# Altium project DCDC.PrjPcb (part 3 of 9)
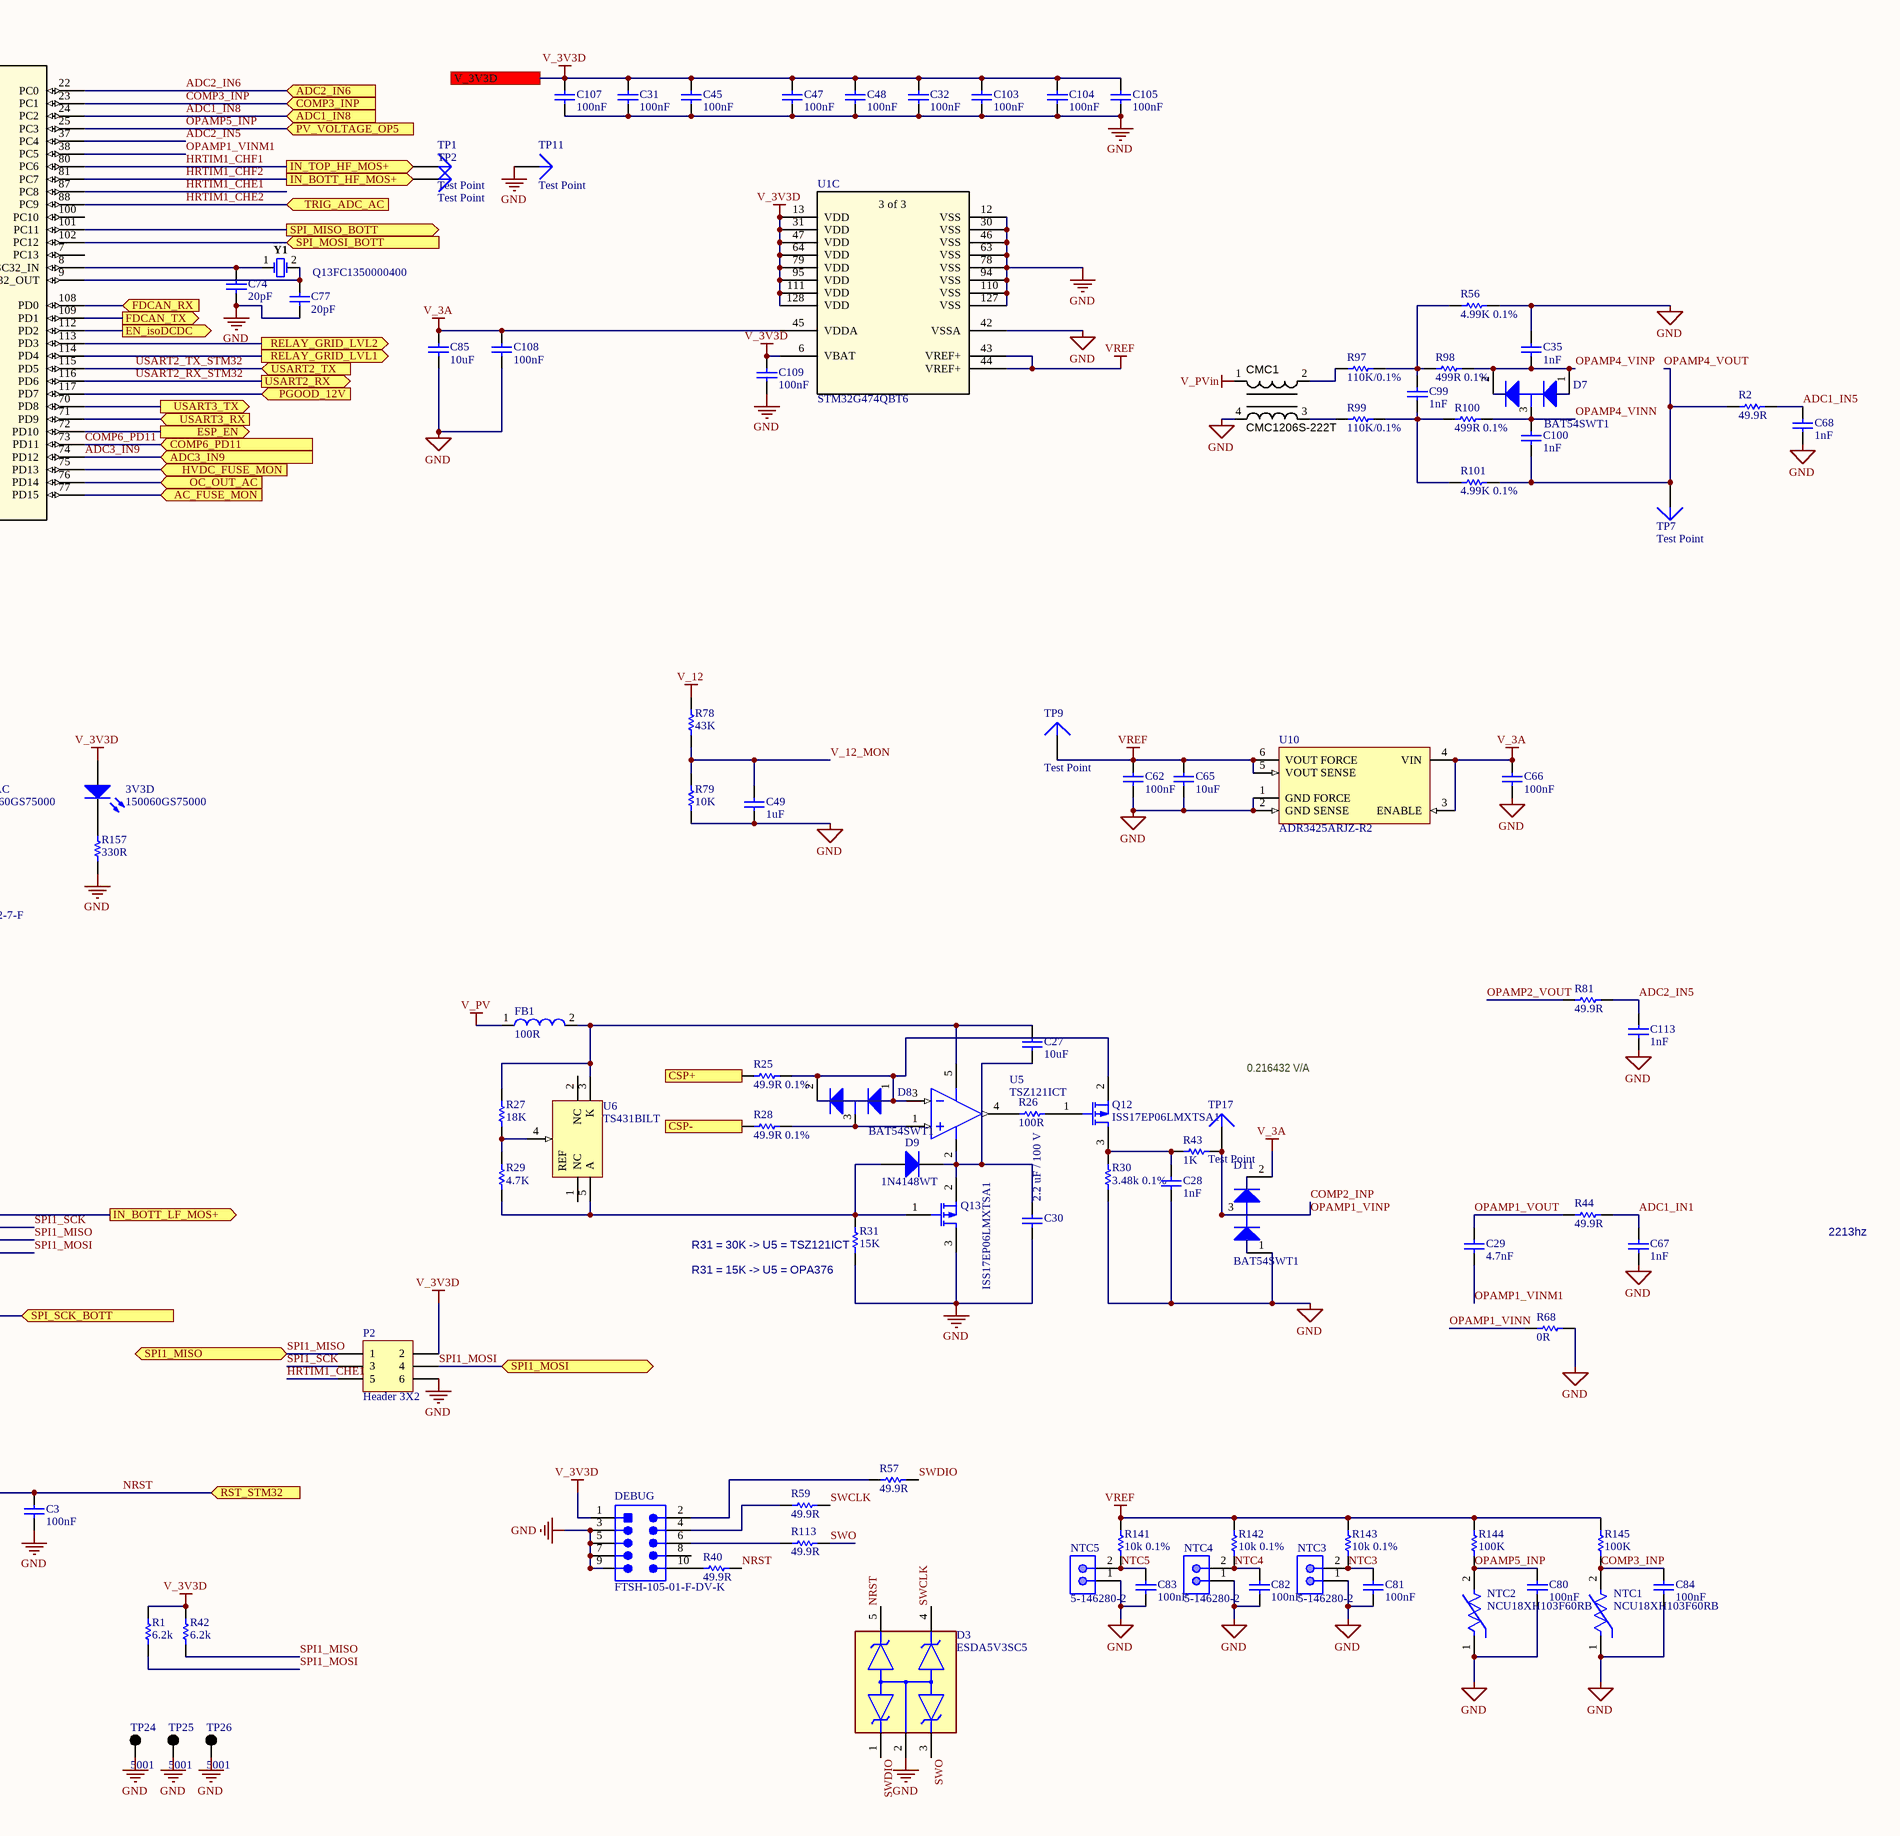
[diagram p10: MCU.SchDoc, right]

## Sheet MCU.SchDoc (continued)

### Library data of the parts (continued)
R43 = RES: ±1% ±100ppm/℃ 1kΩ 0.1W 0603 Chip Resistor - Surface Mount ROHS; Part Number: ERJ-3EKF1001V; Manufacturer: Panasonic; Manufacturer Part Number: ERJ3EKF1001V; Resistance: 1kR; Power Rating: 100mW; Voltage Rating: 75V; Temperature Coefficient: 100ppm/°C; Supplier 1: Future Electronics; Supplier Part Number 1: 3028514; RoHS: Yes; Category: Chip SMD Resistors; Stock 1: 430000; Pricing 1: 5000=0.01860, 10000=0.01510, 15000=0.01500, 20000=0.01490 (USD); Mount: Surface Mount; Case/Package: 0603; Number of Pins: 2; Case Code (Metric): 1608; Case Code (Imperial): 0603; Contact Plating: Tin; Size Code: 0603; Min Operating Temperature: -55°C; Max Operating Temperature: 155°C; Packaging: Tape and Reel; Tolerance: 1%; Termination: SMD/SMT; Package Quantity: 5000; Series: ERJ; Resistor Type: Thick Film; Max Power Dissipation: 100mW; Construction: Rectangular; Resistance Tolerance: 1%; Number of Terminations: 2; Features: Automotive AEC-Q200; Voltage Rating (DC): 75V; Technology: THICK FILM; Length: 1.6mm; Width: 0.8mm; Height: 0.45mm; Depth: 0.8mm; Radiation Hardening: No; REACH SVHC: No SVHC; Lead Free: Lead Free; RoHS Compliant: Yes; Military Standard: Not; ComponentLink1URL: https://datasheet.ciiva.com/16768/70260748-16768437.pdf?src-supplier=Allied+Electronics; ComponentLink1Description: https://datasheet.ciiva.com/16768/70260748-16768437.pdf?src-supplier=Allied+Electronics; ComponentLink2URL: https://datasheet.ciiva.com/16774/70260748-16774550.pdf?src-supplier=Allied+Electronics; ComponentLink2Description: https://datasheet.ciiva.com/16774/70260748-16774550.pdf?src-supplier=Allied+Electronics; ComponentLink3URL: https://datasheet.ciiva.com/16449/aoa0000ce2-16449065.pdf?src-supplier=Future+Electronics; ComponentLink3Description: https://datasheet.ciiva.com/16449/aoa0000ce2-16449065.pdf?src-supplier=Future+Electronics; ComponentLink4URL: https://datasheet.ciiva.com/7942/aoa0000ce2-7942427.pdf?src-supplier=Element14; ComponentLink4Description: https://datasheet.ciiva.com/7942/aoa0000ce2-7942427.pdf?src-supplier=Element14; ComponentLink5URL: https://datasheet.ciiva.com/9198/aoa0000ce2-9198923.pdf?src-supplier=Avnet; ComponentLink5Description: https://datasheet.ciiva.com/9198/aoa0000ce2-9198923.pdf?src-supplier=Avnet; ComponentLink6URL: https://datasheet.ciiva.com/46373/1678782-46373339.pdf?src-supplier=Element14; ComponentLink6Description: https://datasheet.ciiva.com/46373/1678782-46373339.pdf?src-supplier=Element14; ComponentLink7URL: https://datasheet.ciiva.com/48530/aoa0000ce2-48530987.pdf?src-supplier=Avnet; ComponentLink7Description: https://datasheet.ciiva.com/48530/aoa0000ce2-48530987.pdf?src-supplier=Avnet; ComponentLink8URL: https://datasheet.ciiva.com/46373/1678782-46373340.pdf?src-supplier=Element14; ComponentLink8Description: https://datasheet.ciiva.com/46373/1678782-46373340.pdf?src-supplier=Element14; ComponentLink9URL: https://datasheet.ciiva.com/24070/aoa0000ce2-24070269.pdf?src-supplier=Mouser; ComponentLink9Description: https://datasheet.ciiva.com/24070/aoa0000ce2-24070269.pdf?src-supplier=Mouser; ComponentLink10URL: https://datasheet.ciiva.com/22673/1678782-22673918.pdf?src-supplier=Element14; ComponentLink10Description: https://datasheet.ciiva.com/22673/1678782-22673918.pdf?src-supplier=Element14; ComponentLink11URL: https://datasheet.ciiva.com/30063/aoa0000ce2-30063390.pdf?src-supplier=Onlinecomponents.com; ComponentLink11Description: https://datasheet.ciiva.com/30063/aoa0000ce2-30063390.pdf?src-supplier=Onlinecomponents.com; ComponentLink12URL: https://datasheet.ciiva.com/17215/aoa0000ce2-17215311.pdf?src-supplier=Avnet+Europe; ComponentLink12Description: https://datasheet.ciiva.com/17215/aoa0000ce2-17215311.pdf?src-supplier=Avnet+Europe; Parameter 1: *; JLCPCB Part #: C21190
R56 R101 = CMP-2000-00874-1: Part Number: ERA-3AEB103V; Manufacturer: Panasonic; Resistance: 10kR; Temperature Coefficient: 25ppm/°C; Power Rating: 100mW; Voltage Rating: 75V; Supplier 1: Digi-Key; Supplier Part Number 1: P10KDBCT-ND; Manufacturer Part Number: ERA-3AEB103V; Stock 1: 1673404; Pricing 1: 1=0,35000, 10=0,30000, 100=0,11720, 1000=0,04906, 2500=0,04498 (USD); RoHS: Yes; Mount: Surface Mount; Case/Package: 0603; Number of Pins: 2; Contact Plating: Tin; Case Code (Metric): 1608; Case Code (Imperial): 0603; Min Operating Temperature: -55°C; Max Operating Temperature: 155°C; Tolerance: 0.1%; Composition: Thin Film,Metal Film; Packaging: Tape and Reel; Package Quantity: 5000; Number of Terminations: 2; Termination: SMD/SMT; Military Standard: Not; Max Power Dissipation: 100mW; Voltage Rating (DC): 75V; Length: 1.6mm; Height: 0.45mm; Width: 0.8mm; Depth: 0.8mm; Radiation Hardening: No; REACH SVHC: No SVHC; Lead Free: Lead Free; ComponentLink1URL: https://datasheet.ciiva.com/5734/485442-5734528.pdf?src-supplier=Farnell; ComponentLink1Description: https://datasheet.ciiva.com/5734/485442-5734528.pdf?src-supplier=Farnell; ComponentLink2URL: https://datasheet.ciiva.com/11808/0900766b80fe20f7-11808028.pdf?src-supplier=RSComponents; ComponentLink2Description: https://datasheet.ciiva.com/11808/0900766b80fe20f7-11808028.pdf?src-supplier=RSComponents; ComponentLink3URL: https://datasheet.ciiva.com/29183/451250-da-01-en-widerstand-0603-era-29183809.pdf?src-supplier=Conrad; ComponentLink3Description: https://datasheet.ciiva.com/29183/451250-da-01-en-widerstand-0603-era-29183809.pdf?src-supplier=Conrad; ComponentLink4URL: https://datasheet.ciiva.com/46422/1776116-46422520.pdf?src-supplier=Element14; ComponentLink4Description: https://datasheet.ciiva.com/46422/1776116-46422520.pdf?src-supplier=Element14; ComponentLink5URL: https://datasheet.ciiva.com/24072/aoa0000ce26-197354-24072585.pdf?src-supplier=Mouser; ComponentLink5Description: https://datasheet.ciiva.com/24072/aoa0000ce26-197354-24072585.pdf?src-supplier=Mouser; ComponentLink6URL: https://datasheet.ciiva.com/30126/54aoa0000ce26-30126478.pdf?src-supplier=Onlinecomponents.com; ComponentLink6Description: https://datasheet.ciiva.com/30126/54aoa0000ce26-30126478.pdf?src-supplier=Onlinecomponents.com; ComponentLink7URL: https://datasheet.ciiva.com/5734/aoa0000ce26-5734527.pdf?src-supplier=Farnell; ComponentLink7Description: https://datasheet.ciiva.com/5734/aoa0000ce26-5734527.pdf?src-supplier=Farnell; ComponentLink8URL: https://datasheet.ciiva.com/17212/aoa0000ce26-17212070.pdf?src-supplier=Avnet+Europe; ComponentLink8Description: https://datasheet.ciiva.com/17212/aoa0000ce26-17212070.pdf?src-supplier=Avnet+Europe; ComponentLink9URL: https://datasheet.ciiva.com/9194/aoa0000ce26-9194213.pdf?src-supplier=Avnet; ComponentLink9Description: https://datasheet.ciiva.com/9194/aoa0000ce26-9194213.pdf?src-supplier=Avnet; ComponentLink10URL: https://datasheet.ciiva.com/46376/485442-46376357.pdf?src-supplier=Element14; ComponentLink10Description: https://datasheet.ciiva.com/46376/485442-46376357.pdf?src-supplier=Element14; ComponentLink11URL: https://datasheet.ciiva.com/16427/aoa0000ce26-16427097.pdf?src-supplier=Future+Electronics; ComponentLink11Description: https://datasheet.ciiva.com/16427/aoa0000ce26-16427097.pdf?src-supplier=Future+Electronics; ComponentLink12URL: https://datasheet.ciiva.com/46388/1776116-46388109.pdf?src-supplier=Element14; ComponentLink12Description: https://datasheet.ciiva.com/46388/1776116-46388109.pdf?src-supplier=Element14; ComponentLink13URL: https://datasheet.ciiva.com/46388/485442-46388110.pdf?src-supplier=Element14; ComponentLink13Description: https://datasheet.ciiva.com/46388/485442-46388110.pdf?src-supplier=Element14; Parameter 1: *; JLCPCB Part #: *
R78 = CMP-2000-00918-1: ±1% ±100ppm/℃ 43kΩ 0.1W 0603 Chip Resistor - Surface Mount ROHS; Part Number: ERA3AEB154V; Manufacturer: Panasonic; Manufacturer Part Number: ERA-3AEB154V; Resistance: 150kR; Tolerance: 0.1%; Temperature Coefficient: 25ppm/°C; Power Rating: 100mW; Voltage Rating: 75V; Supplier 1: Digi-Key; Supplier Part Number 1: P150KDBCT-ND; Stock 1: 137847; Pricing 1: 1=0,35000, 10=0,30000, 100=0,11720, 1000=0,04906, 2500=0,04498 (USD); RoHS: Yes; Mount: Surface Mount; Case/Package: 0603; Number of Pins: 2; Case Code (Metric): 1608; Case Code (Imperial): 0603; Contact Plating: Tin; Min Operating Temperature: -55°C; Max Operating Temperature: 155°C; Packaging: Tape and Reel; Composition: Metal Film,Thin Film; Termination: SMD/SMT; Number of Terminations: 2; Voltage Rating (DC): 75V; Package Quantity: 1; Max Power Dissipation: 100mW; Features: Automotive AEC-Q200; Military Standard: Not; Length: 1.6mm; Height: 0.45mm; Width: 0.8mm; Depth: 0.8mm; Radiation Hardening: No; Lead Free: Lead Free; REACH SVHC: No SVHC; ComponentLink1URL: https://datasheet.ciiva.com/11808/0900766b80fe20f7-11808025.pdf?src-supplier=RSComponents; ComponentLink1Description: https://datasheet.ciiva.com/11808/0900766b80fe20f7-11808025.pdf?src-supplier=RSComponents; ComponentLink2URL: https://datasheet.ciiva.com/29183/451718-da-01-en-widerstand-0603-era-29183878.pdf?src-supplier=Conrad; ComponentLink2Description: https://datasheet.ciiva.com/29183/451718-da-01-en-widerstand-0603-era-29183878.pdf?src-supplier=Conrad; ComponentLink3URL: https://datasheet.ciiva.com/24070/aoa0000ce26-197354-24070709.pdf?src-supplier=Mouser; ComponentLink3Description: https://datasheet.ciiva.com/24070/aoa0000ce26-197354-24070709.pdf?src-supplier=Mouser; ComponentLink4URL: https://datasheet.ciiva.com/9117/aoa0000ce26-9117369.pdf?src-supplier=Avnet; ComponentLink4Description: https://datasheet.ciiva.com/9117/aoa0000ce26-9117369.pdf?src-supplier=Avnet; ComponentLink5URL: https://datasheet.ciiva.com/16767/70068849-16767065.pdf?src-supplier=Allied+Electronics; ComponentLink5Description: https://datasheet.ciiva.com/16767/70068849-16767065.pdf?src-supplier=Allied+Electronics; ComponentLink6URL: https://datasheet.ciiva.com/30175/54aoa0000ce26-30175385.pdf?src-supplier=Onlinecomponents.com; ComponentLink6Description: https://datasheet.ciiva.com/30175/54aoa0000ce26-30175385.pdf?src-supplier=Onlinecomponents.com; ComponentLink7URL: https://datasheet.ciiva.com/6001/485442-6001674.pdf?src-supplier=Farnell; ComponentLink7Description: https://datasheet.ciiva.com/6001/485442-6001674.pdf?src-supplier=Farnell; ComponentLink8URL: https://datasheet.ciiva.com/6001/485442-6001675.pdf?src-supplier=Farnell; ComponentLink8Description: https://datasheet.ciiva.com/6001/485442-6001675.pdf?src-supplier=Farnell; ComponentLink9URL: https://datasheet.ciiva.com/17207/aoa0000ce26-17207467.pdf?src-supplier=Avnet+Europe; ComponentLink9Description: https://datasheet.ciiva.com/17207/aoa0000ce26-17207467.pdf?src-supplier=Avnet+Europe; ComponentLink10URL: https://datasheet.ciiva.com/36857/485442-36857163.pdf?src-supplier=Element14; ComponentLink10Description: https://datasheet.ciiva.com/36857/485442-36857163.pdf?src-supplier=Element14; ComponentLink11URL: https://datasheet.ciiva.com/9117/aoa0000ce26-9117373.pdf?src-supplier=Avnet; ComponentLink11Description: https://datasheet.ciiva.com/9117/aoa0000ce26-9117373.pdf?src-supplier=Avnet; ComponentLink12URL: https://datasheet.ciiva.com/43455/485442-43455245.pdf?src-supplier=Farnell; ComponentLink12Description: https://datasheet.ciiva.com/43455/485442-43455245.pdf?src-supplier=Farnell; ComponentLink13URL: https://datasheet.ciiva.com/16212/aoa0000ce26-16212095.pdf?src-supplier=Future+Electronics; ComponentLink13Description: https://datasheet.ciiva.com/16212/aoa0000ce26-16212095.pdf?src-supplier=Future+Electronics; ComponentLink14URL: https://datasheet.ciiva.com/16770/70068849-16770767.pdf?src-supplier=Allied+Electronics; ComponentLink14Description: https://datasheet.ciiva.com/16770/70068849-16770767.pdf?src-supplier=Allied+Electronics; ComponentLink15URL: https://datasheet.ciiva.com/28691/485442-28691903.pdf?src-supplier=Element14; ComponentLink15Description: https://datasheet.ciiva.com/28691/485442-28691903.pdf?src-supplier=Element14; Parameter 1: *; JLCPCB Part #: C23172
R81 = CMP-2002-00969-1: 1/16W ±1% ±200ppm/℃ 49.9Ω 0402 Chip Resistor - Surface Mount ROHS; Manufacturer: Panasonic; Part Number: ERJ-2RKF49R9X; Parameter 1: *; JLCPCB Part #: C25120
R97 R99 = CMP-2000-00918-1: Part Number: ERA3AEB154V; Manufacturer: Panasonic; Manufacturer Part Number: ERA-3AEB154V; Resistance: 150kR; Tolerance: 0.1%; Temperature Coefficient: 25ppm/°C; Power Rating: 100mW; Voltage Rating: 75V; Supplier 1: Digi-Key; Supplier Part Number 1: P150KDBCT-ND; Stock 1: 137847; Pricing 1: 1=0,35000, 10=0,30000, 100=0,11720, 1000=0,04906, 2500=0,04498 (USD); RoHS: Yes; Mount: Surface Mount; Case/Package: 0603; Number of Pins: 2; Case Code (Metric): 1608; Case Code (Imperial): 0603; Contact Plating: Tin; Min Operating Temperature: -55°C; Max Operating Temperature: 155°C; Packaging: Tape and Reel; Composition: Metal Film,Thin Film; Termination: SMD/SMT; Number of Terminations: 2; Voltage Rating (DC): 75V; Package Quantity: 1; Max Power Dissipation: 100mW; Features: Automotive AEC-Q200; Military Standard: Not; Length: 1.6mm; Height: 0.45mm; Width: 0.8mm; Depth: 0.8mm; Radiation Hardening: No; Lead Free: Lead Free; REACH SVHC: No SVHC; ComponentLink1URL: https://datasheet.ciiva.com/11808/0900766b80fe20f7-11808025.pdf?src-supplier=RSComponents; ComponentLink1Description: https://datasheet.ciiva.com/11808/0900766b80fe20f7-11808025.pdf?src-supplier=RSComponents; ComponentLink2URL: https://datasheet.ciiva.com/29183/451718-da-01-en-widerstand-0603-era-29183878.pdf?src-supplier=Conrad; ComponentLink2Description: https://datasheet.ciiva.com/29183/451718-da-01-en-widerstand-0603-era-29183878.pdf?src-supplier=Conrad; ComponentLink3URL: https://datasheet.ciiva.com/24070/aoa0000ce26-197354-24070709.pdf?src-supplier=Mouser; ComponentLink3Description: https://datasheet.ciiva.com/24070/aoa0000ce26-197354-24070709.pdf?src-supplier=Mouser; ComponentLink4URL: https://datasheet.ciiva.com/9117/aoa0000ce26-9117369.pdf?src-supplier=Avnet; ComponentLink4Description: https://datasheet.ciiva.com/9117/aoa0000ce26-9117369.pdf?src-supplier=Avnet; ComponentLink5URL: https://datasheet.ciiva.com/16767/70068849-16767065.pdf?src-supplier=Allied+Electronics; ComponentLink5Description: https://datasheet.ciiva.com/16767/70068849-16767065.pdf?src-supplier=Allied+Electronics; ComponentLink6URL: https://datasheet.ciiva.com/30175/54aoa0000ce26-30175385.pdf?src-supplier=Onlinecomponents.com; ComponentLink6Description: https://datasheet.ciiva.com/30175/54aoa0000ce26-30175385.pdf?src-supplier=Onlinecomponents.com; ComponentLink7URL: https://datasheet.ciiva.com/6001/485442-6001674.pdf?src-supplier=Farnell; ComponentLink7Description: https://datasheet.ciiva.com/6001/485442-6001674.pdf?src-supplier=Farnell; ComponentLink8URL: https://datasheet.ciiva.com/6001/485442-6001675.pdf?src-supplier=Farnell; ComponentLink8Description: https://datasheet.ciiva.com/6001/485442-6001675.pdf?src-supplier=Farnell; ComponentLink9URL: https://datasheet.ciiva.com/17207/aoa0000ce26-17207467.pdf?src-supplier=Avnet+Europe; ComponentLink9Description: https://datasheet.ciiva.com/17207/aoa0000ce26-17207467.pdf?src-supplier=Avnet+Europe; ComponentLink10URL: https://datasheet.ciiva.com/36857/485442-36857163.pdf?src-supplier=Element14; ComponentLink10Description: https://datasheet.ciiva.com/36857/485442-36857163.pdf?src-supplier=Element14; ComponentLink11URL: https://datasheet.ciiva.com/9117/aoa0000ce26-9117373.pdf?src-supplier=Avnet; ComponentLink11Description: https://datasheet.ciiva.com/9117/aoa0000ce26-9117373.pdf?src-supplier=Avnet; ComponentLink12URL: https://datasheet.ciiva.com/43455/485442-43455245.pdf?src-supplier=Farnell; ComponentLink12Description: https://datasheet.ciiva.com/43455/485442-43455245.pdf?src-supplier=Farnell; ComponentLink13URL: https://datasheet.ciiva.com/16212/aoa0000ce26-16212095.pdf?src-supplier=Future+Electronics; ComponentLink13Description: https://datasheet.ciiva.com/16212/aoa0000ce26-16212095.pdf?src-supplier=Future+Electronics; ComponentLink14URL: https://datasheet.ciiva.com/16770/70068849-16770767.pdf?src-supplier=Allied+Electronics; ComponentLink14Description: https://datasheet.ciiva.com/16770/70068849-16770767.pdf?src-supplier=Allied+Electronics; ComponentLink15URL: https://datasheet.ciiva.com/28691/485442-28691903.pdf?src-supplier=Element14; ComponentLink15Description: https://datasheet.ciiva.com/28691/485442-28691903.pdf?src-supplier=Element14; Parameter 1: *; JLCPCB Part #: *
R98 R100 = RES: Res Thin Film 0603 499 Ohm 0.1% 1/10W ±25ppm/°C Molded SMD SMD Punched Carrier T/R; Part Number: ERA3AEB4990V; Manufacturer: Panasonic; Manufacturer Part Number: ERA-3AEB4990V; Power Rating: 100mW; Voltage Rating: 150V; Voltage Rating (DC): 75V; Supplier 1: Digi-Key; Supplier Part Number 1: P499DBCT-ND; RoHS: Yes; Category: Chip SMD Resistors; Stock 1: 51561; Pricing 1: 1=0.31000, 10=0.26000, 100=0.10150, 1000=0.04248, 2500=0.03894 (USD); Mount: Surface Mount; Case/Package: 0603; Number of Pins: 2; Case Code (Metric): 1608; Case Code (Imperial): 0603; Contact Plating: Tin; Min Operating Temperature: -55°C; Max Operating Temperature: 155°C; Resistance: 499R; Tolerance: 0.1%; Packaging: Tape and Reel; Resistor Type: Thin Film,Metal Film; Temperature Coefficient: 25ppm/°C; Package Quantity: 1; Number of Terminations: 2; Termination: SMD/SMT; Max Power Dissipation: 100mW; Series: ERA-3A; Resistance Tolerance: 0.1%; Construction: Rectangular; Features: Automotive AEC-Q200; Technology: METAL FILM; Length: 1.6mm; Width: 0.8mm; Height: 0.45mm; Depth: 0.8mm; Radiation Hardening: No; RoHS Compliant: Yes; Lead Free: Lead Free; REACH SVHC: No SVHC; Military Standard: Not; ComponentLink1URL: https://datasheet.ciiva.com/11810/0900766b80eb1d8c-11810911.pdf?src-supplier=RSComponents; ComponentLink1Description: https://datasheet.ciiva.com/11810/0900766b80eb1d8c-11810911.pdf?src-supplier=RSComponents; ComponentLink2URL: https://datasheet.ciiva.com/29183/451973-da-01-en-widerstand-0603-era-29183924.pdf?src-supplier=Conrad; ComponentLink2Description: https://datasheet.ciiva.com/29183/451973-da-01-en-widerstand-0603-era-29183924.pdf?src-supplier=Conrad; ComponentLink3URL: https://datasheet.ciiva.com/9181/aoa0000ce26-9181477.pdf?src-supplier=Avnet; ComponentLink3Description: https://datasheet.ciiva.com/9181/aoa0000ce26-9181477.pdf?src-supplier=Avnet; ComponentLink4URL: https://datasheet.ciiva.com/17205/aoa0000ce26-17205477.pdf?src-supplier=Avnet+Europe; ComponentLink4Description: https://datasheet.ciiva.com/17205/aoa0000ce26-17205477.pdf?src-supplier=Avnet+Europe; ComponentLink5URL: https://datasheet.ciiva.com/30161/54aoa0000ce26-30161593.pdf?src-supplier=Onlinecomponents.com; ComponentLink5Description: https://datasheet.ciiva.com/30161/54aoa0000ce26-30161593.pdf?src-supplier=Onlinecomponents.com; ComponentLink6URL: https://datasheet.ciiva.com/7920/485442-7920378.pdf?src-supplier=Element14; ComponentLink6Description: https://datasheet.ciiva.com/7920/485442-7920378.pdf?src-supplier=Element14; ComponentLink7URL: https://datasheet.ciiva.com/7920/485442-7920379.pdf?src-supplier=Element14; ComponentLink7Description: https://datasheet.ciiva.com/7920/485442-7920379.pdf?src-supplier=Element14; ComponentLink8URL: https://datasheet.ciiva.com/6201/485442-6201036.pdf?src-supplier=Farnell; ComponentLink8Description: https://datasheet.ciiva.com/6201/485442-6201036.pdf?src-supplier=Farnell; Parameter 1: *; JLCPCB Part #: *
R107 R108 = CMP-1659-00020-2: ±1% 330Ω ±100ppm/℃ 0.1W 0603 Chip Resistor - Surface Mount ROHS; Tolerance: 10%; ESR: 800 mohm; Voltage Rating (DC): 16 V; Capacitance: 47 uF; Length: 7.3 mm; ComponentLink1URL: http://www.yageo.com/; Packaging: Tape and Reel; Pins: 2; ComponentLink1Description: Manufacturer URL; Case Code (Imperial): 2917; REACH SVHC: No SVHC; Width: 4.3 mm; ComponentLink2Description: Datasheet; Voltage Rating: 16 V; RoHSCompliant: True; Max Operating Temperature: 125degC; ComponentLink2URL: http://www.yageo.com/documents/recent/PYu-RC_Group_51_RoHS_L_04.pdf; Min Operating Temperature: -55degC; Case/Package: 2917; Radiation Hardening: No; DatasheetVersion: Rev. 4, 02/2016; Mount: Surface Mount; PackageReference: 0603; Package Quantity: 500; Case Code (Metric): 7343; PackageDescription: 2-Pin Surface Mount Device, Body 1.6 x 0.8 mm; Height: 3.1 mm; Parameter 1: *; JLCPCB Part #: C23138
R125 R153 = RES-2: ±1% 330Ω ±100ppm/℃ 0.1W 0603 Chip Resistor - Surface Mount ROHS; Manufacturer: Yageo; Manufacturer Part Number: RC0603FR-07330RL; Tolerance: 10%; ESR: 800 mohm; Voltage Rating (DC): 16 V; Capacitance: 47 uF; Temperature Coefficient: 100ppm/°C; Power Rating: 100mW; Length: 7.3 mm; ComponentLink1URL: http://www.yageo.com/; Packaging: Tape and Reel; Pins: 2; ComponentLink1Description: Manufacturer URL; Case Code (Imperial): 2917; REACH SVHC: No SVHC; Width: 4.3 mm; ComponentLink2Description: Datasheet; Voltage Rating: 16 V; RoHSCompliant: True; Max Operating Temperature: 125degC; ComponentLink2URL: http://www.yageo.com/documents/recent/PYu-RC_Group_51_RoHS_L_04.pdf; Min Operating Temperature: -55degC; Case/Package: 2917; Radiation Hardening: No; DatasheetVersion: Rev. 4, 02/2016; Mount: Surface Mount; PackageReference: 0603; Package Quantity: 500; Case Code (Metric): 7343; PackageDescription: 2-Pin Surface Mount Device, Body 1.6 x 0.8 mm; Height: 3.1 mm; Supplier 1: Digi-Key; Supplier Part Number 1: 311-330HRCT-ND; RoHS: Yes; Category: Chip SMD Resistors; Stock 1: 4209654; Pricing 1: 1=0.10000, 10=0.02300, 100=0.00940, 1000=0.00421, 2500=0.00366 (USD); Number of Pins: 2; Composition: Thick Film; Resistance: 330R; Number of Terminations: 2; Max Power Dissipation: 100mW; Termination: SMD/SMT; Features: Moisture Resistant; Depth: 0.8mm; Lead Free: Lead Free; ComponentLink3URL: https://datasheet.ciiva.com/11819/0900766b80f96399-11819327.pdf?src-supplier=RSComponents; ComponentLink3Description: https://datasheet.ciiva.com/11819/0900766b80f96399-11819327.pdf?src-supplier=RSComponents; ComponentLink4URL: https://datasheet.ciiva.com/2454/pyu-r-int-thick-7-2454864.pdf?src-supplier=Digi-Key; ComponentLink4Description: https://datasheet.ciiva.com/2454/pyu-r-int-thick-7-2454864.pdf?src-supplier=Digi-Key; ComponentLink5URL: https://datasheet.ciiva.com/2454/pyu-r-int-thick-7-2454865.pdf?src-supplier=Digi-Key; ComponentLink5Description: https://datasheet.ciiva.com/2454/pyu-r-int-thick-7-2454865.pdf?src-supplier=Digi-Key; ComponentLink6URL: https://datasheet.ciiva.com/2454/pyu-r-int-thick-7-2454866.pdf?src-supplier=Digi-Key; ComponentLink6Description: https://datasheet.ciiva.com/2454/pyu-r-int-thick-7-2454866.pdf?src-supplier=Digi-Key; ComponentLink7URL: https://datasheet.ciiva.com/12555/rc0603-272842-12555334.pdf?src-supplier=Mouser; ComponentLink7Description: https://datasheet.ciiva.com/12555/rc0603-272842-12555334.pdf?src-supplier=Mouser; ComponentLink8URL: https://datasheet.ciiva.com/46440/1868787-46440904.pdf?src-supplier=Element14; ComponentLink8Description: https://datasheet.ciiva.com/46440/1868787-46440904.pdf?src-supplier=Element14; ComponentLink9URL: https://datasheet.ciiva.com/7746/443971-7746329.pdf?src-supplier=Element14; ComponentLink9Description: https://datasheet.ciiva.com/7746/443971-7746329.pdf?src-supplier=Element14; ComponentLink10URL: https://datasheet.ciiva.com/7746/443971-7746330.pdf?src-supplier=Element14; ComponentLink10Description: https://datasheet.ciiva.com/7746/443971-7746330.pdf?src-supplier=Element14; ComponentLink11URL: https://datasheet.ciiva.com/7746/1686128-7746331.pdf?src-supplier=Element14; ComponentLink11Description: https://datasheet.ciiva.com/7746/1686128-7746331.pdf?src-supplier=Element14; Parameter 1: *; JLCPCB Part #: C23138
R144 R145 = RES-2: ±1% 100kΩ ±100ppm/℃ 0.1W 0603 Chip Resistor - Surface Mount ROHS; Manufacturer: Yageo; Manufacturer Part Number: RC0603JR-071ML; Power Rating: 100mW; Resistance Tolerance: ±5%; Product Range: RCSeries; Temperature Coefficient: ±100ppm/°C; Resistor Element Type: ThickFilm; Resistance: 1Mohm; SVHC: ToBeAdvised; Voltage Rating: 50V; Resistor Case Style: 0603[1608Metric]; Tolerance: 5%; MSL: MSL1-Unlimited; Package Description: 2-Pin Surface Mount Device, Body 1.6 x 0.8 mm; Datasheet Version: Rev. 7, 05/2017; Datasheet URL: http://www.yageo.com/documents/recent/PYu-RC_Group_51_RoHS_L_7.pdf; Manufacturer URL: http://www.yageo.com/; Package Reference: 0603; Automotive Qualification Standard: -; Packaging: CutTape; Mounting Technology: SurfaceMount; Supplier 1: Digi-Key; Supplier Part Number 1: 311-1.0MGRCT-ND; Stock 1: 3949362; Pricing 1: 1=0,10000, 10=0,01900, 100=0,00770, 1000=0,00347, 2500=0,00301 (USD); RoHS: Yes; Case/Package: 0603; Number of Pins: 2; Case Code (Imperial): 0603; Case Code (Metric): 1608; Contact Plating: Tin,Matte; Min Operating Temperature: -55°C; Max Operating Temperature: 155°C; Composition: Thick Film; Termination: SMD/SMT; Package Quantity: 5000; Military Standard: Not; Voltage Rating (DC): 50V; Length: 1.6mm; Height: 0.45mm; Width: 0.8mm; Depth: 0.8mm; Radiation Hardening: No; Lead Free: Lead Free; REACH SVHC: No SVHC; ComponentLink1URL: https://datasheet.ciiva.com/46395/443971-46395067.pdf?src-supplier=Element14; ComponentLink1Description: https://datasheet.ciiva.com/46395/443971-46395067.pdf?src-supplier=Element14; ComponentLink2URL: https://datasheet.ciiva.com/8883/pyu-rc0603-51-rohs-l-4-8883053.pdf?src-supplier=Avnet; ComponentLink2Description: https://datasheet.ciiva.com/8883/pyu-rc0603-51-rohs-l-4-8883053.pdf?src-supplier=Avnet; ComponentLink3URL: https://datasheet.ciiva.com/12555/rc0603-272842-12555342.pdf?src-supplier=Mouser; ComponentLink3Description: https://datasheet.ciiva.com/12555/rc0603-272842-12555342.pdf?src-supplier=Mouser; ComponentLink4URL: https://datasheet.ciiva.com/7746/443971-7746463.pdf?src-supplier=Element14; ComponentLink4Description: https://datasheet.ciiva.com/7746/443971-7746463.pdf?src-supplier=Element14; Parameter 1: *; JLCPCB Part #: C25803
R154 R157 = CMP-1659-00020-2: ±1% 330Ω ±100ppm/℃ 0.1W 0603 Chip Resistor - Surface Mount ROHS; Manufacturer: Yageo; Manufacturer Part Number: RC0603FR-07330RL; Tolerance: 10%; ESR: 800 mohm; Voltage Rating (DC): 16 V; Capacitance: 47 uF; Temperature Coefficient: 100ppm/°C; Power Rating: 100mW; Length: 7.3 mm; ComponentLink1URL: http://www.yageo.com/; Packaging: Tape and Reel; Pins: 2; ComponentLink1Description: Manufacturer URL; Case Code (Imperial): 2917; REACH SVHC: No SVHC; Width: 4.3 mm; ComponentLink2Description: Datasheet; Voltage Rating: 16 V; RoHSCompliant: True; Max Operating Temperature: 125degC; ComponentLink2URL: http://www.yageo.com/documents/recent/PYu-RC_Group_51_RoHS_L_04.pdf; Min Operating Temperature: -55degC; Case/Package: 2917; Radiation Hardening: No; DatasheetVersion: Rev. 4, 02/2016; Mount: Surface Mount; PackageReference: 0603; Package Quantity: 500; Case Code (Metric): 7343; PackageDescription: 2-Pin Surface Mount Device, Body 1.6 x 0.8 mm; Height: 3.1 mm; Supplier 1: Digi-Key; Supplier Part Number 1: 311-330HRCT-ND; RoHS: Yes; Category: Chip SMD Resistors; Stock 1: 4209654; Pricing 1: 1=0.10000, 10=0.02300, 100=0.00940, 1000=0.00421, 2500=0.00366 (USD); Number of Pins: 2; Composition: Thick Film; Resistance: 330R; Number of Terminations: 2; Max Power Dissipation: 100mW; Termination: SMD/SMT; Features: Moisture Resistant; Depth: 0.8mm; Lead Free: Lead Free; ComponentLink3URL: https://datasheet.ciiva.com/11819/0900766b80f96399-11819327.pdf?src-supplier=RSComponents; ComponentLink3Description: https://datasheet.ciiva.com/11819/0900766b80f96399-11819327.pdf?src-supplier=RSComponents; ComponentLink4URL: https://datasheet.ciiva.com/2454/pyu-r-int-thick-7-2454864.pdf?src-supplier=Digi-Key; ComponentLink4Description: https://datasheet.ciiva.com/2454/pyu-r-int-thick-7-2454864.pdf?src-supplier=Digi-Key; ComponentLink5URL: https://datasheet.ciiva.com/2454/pyu-r-int-thick-7-2454865.pdf?src-supplier=Digi-Key; ComponentLink5Description: https://datasheet.ciiva.com/2454/pyu-r-int-thick-7-2454865.pdf?src-supplier=Digi-Key; ComponentLink6URL: https://datasheet.ciiva.com/2454/pyu-r-int-thick-7-2454866.pdf?src-supplier=Digi-Key; ComponentLink6Description: https://datasheet.ciiva.com/2454/pyu-r-int-thick-7-2454866.pdf?src-supplier=Digi-Key; ComponentLink7URL: https://datasheet.ciiva.com/12555/rc0603-272842-12555334.pdf?src-supplier=Mouser; ComponentLink7Description: https://datasheet.ciiva.com/12555/rc0603-272842-12555334.pdf?src-supplier=Mouser; ComponentLink8URL: https://datasheet.ciiva.com/46440/1868787-46440904.pdf?src-supplier=Element14; ComponentLink8Description: https://datasheet.ciiva.com/46440/1868787-46440904.pdf?src-supplier=Element14; ComponentLink9URL: https://datasheet.ciiva.com/7746/443971-7746329.pdf?src-supplier=Element14; ComponentLink9Description: https://datasheet.ciiva.com/7746/443971-7746329.pdf?src-supplier=Element14; ComponentLink10URL: https://datasheet.ciiva.com/7746/443971-7746330.pdf?src-supplier=Element14; ComponentLink10Description: https://datasheet.ciiva.com/7746/443971-7746330.pdf?src-supplier=Element14; ComponentLink11URL: https://datasheet.ciiva.com/7746/1686128-7746331.pdf?src-supplier=Element14; ComponentLink11Description: https://datasheet.ciiva.com/7746/1686128-7746331.pdf?src-supplier=Element14; Parameter 1: *; JLCPCB Part #: C23138
R155 R156 = CMP-2000-06953-1: ±1% 100kΩ ±100ppm/℃ 0.1W 0603 Chip Resistor - Surface Mount ROHS; Manufacturer: Yageo; Manufacturer Part Number: RC0603JR-071ML; Power Rating: 100mW; Resistance Tolerance: ±5%; Product Range: RCSeries; Temperature Coefficient: ±100ppm/°C; Resistor Element Type: ThickFilm; Resistance: 1Mohm; SVHC: ToBeAdvised; Voltage Rating: 50V; Resistor Case Style: 0603[1608Metric]; Tolerance: 5%; MSL: MSL1-Unlimited; Package Description: 2-Pin Surface Mount Device, Body 1.6 x 0.8 mm; Datasheet Version: Rev. 7, 05/2017; Datasheet URL: http://www.yageo.com/documents/recent/PYu-RC_Group_51_RoHS_L_7.pdf; Manufacturer URL: http://www.yageo.com/; Package Reference: 0603; Automotive Qualification Standard: -; Packaging: CutTape; Mounting Technology: SurfaceMount; Supplier 1: Digi-Key; Supplier Part Number 1: 311-1.0MGRCT-ND; Stock 1: 3949362; Pricing 1: 1=0,10000, 10=0,01900, 100=0,00770, 1000=0,00347, 2500=0,00301 (USD); RoHS: Yes; Case/Package: 0603; Number of Pins: 2; Case Code (Imperial): 0603; Case Code (Metric): 1608; Contact Plating: Tin,Matte; Min Operating Temperature: -55°C; Max Operating Temperature: 155°C; Composition: Thick Film; Termination: SMD/SMT; Package Quantity: 5000; Military Standard: Not; Voltage Rating (DC): 50V; Length: 1.6mm; Height: 0.45mm; Width: 0.8mm; Depth: 0.8mm; Radiation Hardening: No; Lead Free: Lead Free; REACH SVHC: No SVHC; ComponentLink1URL: https://datasheet.ciiva.com/46395/443971-46395067.pdf?src-supplier=Element14; ComponentLink1Description: https://datasheet.ciiva.com/46395/443971-46395067.pdf?src-supplier=Element14; ComponentLink2URL: https://datasheet.ciiva.com/8883/pyu-rc0603-51-rohs-l-4-8883053.pdf?src-supplier=Avnet; ComponentLink2Description: https://datasheet.ciiva.com/8883/pyu-rc0603-51-rohs-l-4-8883053.pdf?src-supplier=Avnet; ComponentLink3URL: https://datasheet.ciiva.com/12555/rc0603-272842-12555342.pdf?src-supplier=Mouser; ComponentLink3Description: https://datasheet.ciiva.com/12555/rc0603-272842-12555342.pdf?src-supplier=Mouser; ComponentLink4URL: https://datasheet.ciiva.com/7746/443971-7746463.pdf?src-supplier=Element14; ComponentLink4Description: https://datasheet.ciiva.com/7746/443971-7746463.pdf?src-supplier=Element14; Parameter 1: *; JLCPCB Part #: C25803
TP1-TP4 TP7 TP9 TP11 TP17 TP18 = Test_Point 1.5mm round: Round Test Point; LatestRevisionDate: 17-Jul-2002; LatestRevisionNote: Re-released for DXP Platform.; Publisher: Altium Limited; Parameter 1: *; JLCPCB Part #: *
TP24-TP26 = CMP-2000-05181-1: Test Point, Black, 1-Pin THD, RoHS, Bulk; Manufacturer: Keystone; Other Names: 5001K; Catalog Drawings: 5000Series; Alternate Color: 5004K-ND / -TESTPOINTPCMINI.040"DYELLOW / 5003K-ND / -TESTPOINTPCMINI.040"DORANGE / 5002K-ND / -TESTPOINTPCMINI.040"DWHITE / 5000K-ND / -TESTPOINTPCMINI.040"DRED; Kits: DKTGRS232C-KIT-ND / -TTLCONVERTER; Online Catalog: ColorCodedTestPoints; Datasheet URL: https://ciiva.com/datasheet-click-2917627?src=ciiva&sig=bd195616; Mounting Type: 0.040"(1.02mm)HoleDiameter; Family: TestPoints; RoHS Information: RoHSComplianceStatement; Datasheet Version: Rev. G, 12/2008; Color: Black; Category: TestandMeasurement; Standard Package: 100; Manufacturer URL: http://www.keyelco.com/; Material: Base,Nylon46,UL94V-0; Type: PCTestPoint,Miniature; Terminal: 0.010"x0.020"(0.25mmx0.51mm)PhosphorBronzeWire,SilverPlated; Series: THM; Packaging: Bulk; Parameter 1: *; JLCPCB Part #: *
U1 = STM32G4_LPQFP128: No Description Available; Manufacturer_Part_Number: stm32g4_lpqfp128_t1; Built_By: EMA_Jessica; Vendor: STMicroelectronics; Copyright: Copyright (C) 2016 Accelerated Designs. All rights reserved; RefDes: RefDes; Type: DEV; Value: Value; Parameter 1: *; JLCPCB Part #: *
U5 = CMP-0272-01094-3: 35 uA, MicroPower, Precision, Zero Drift CMOS Operational Amplifier, 1.8 to 5.5 V, -40 to 125 degC, 5-pin SOT23 (DCK5), Green (RoHS & no Sb/Br); Manufacturer: STMicroelectronics; Max Supply Voltage: 5.5V; Voltage Gain: 135dB; Gain Bandwidth Product: 400kHz; Min Supply Voltage: 1.8V; Common Mode Rejection Ratio: 112dB; Slew Rate: 0.19V/µs; Input Offset Voltage (Vos): 1uV; Input Bias Current: 70pA; Operating Supply Current: 31uA; Number of Circuits: 1; Output Current per Channel: 18mA; ComponentLink3Description: Package Specification; ComponentLink2URL: http://www.ti.com/general/docs/lit/getliterature.tsp?genericPartNumber=OPA330&fileType=pdf; ComponentLink2Description: Datasheet; ComponentLink1Description: Manufacturer URL; ComponentLink3URL: http://www.ti.com/litv/pdf/mpds025f; ComponentLink1URL: http://www.ti.com/; Supplier 1: Digi-Key; Supplier Part Number 1: 497-13509-1-ND; Manufacturer Part Number: TSZ121ICT; Stock 1: 2840; Pricing 1: 1=1,12000, 10=1,00500, 100=0,78370, 500=0,64736, 1000=0,51108 (USD); RoHS: Yes; Mount: Surface Mount; Case/Package: SC; Number of Pins: 5; Min Operating Temperature: -40°C; Max Operating Temperature: 125°C; Packaging: Tape and Reel; Package Quantity: 3000; Number of Channels: 1; Number of Elements: 1; Output Current: 18mA; Nominal Supply Current: 31uA; Unity Gain Bandwidth Product: 400kHz; Lead Free: Lead Free; ComponentLink4URL: https://datasheet.ciiva.com/41459/001184890-da-01-en-ic-op-amp-zero-dri-tsz121ict-sc-70-5-stm-41459615.pdf?src-supplier=Conrad; ComponentLink4Description: https://datasheet.ciiva.com/41459/001184890-da-01-en-ic-op-amp-zero-dri-tsz121ict-sc-70-5-stm-41459615.pdf?src-supplier=Conrad; ComponentLink5URL: https://datasheet.ciiva.com/6627/dm00062815-6627307.pdf?src-supplier=Digi-Key; ComponentLink5Description: https://datasheet.ciiva.com/6627/dm00062815-6627307.pdf?src-supplier=Digi-Key; ComponentLink6URL: https://datasheet.ciiva.com/6627/dm00062815-6627308.pdf?src-supplier=Digi-Key; ComponentLink6Description: https://datasheet.ciiva.com/6627/dm00062815-6627308.pdf?src-supplier=Digi-Key; ComponentLink7URL: https://datasheet.ciiva.com/6627/dm00062815-6627311.pdf?src-supplier=Digi-Key; ComponentLink7Description: https://datasheet.ciiva.com/6627/dm00062815-6627311.pdf?src-supplier=Digi-Key; Parameter 1: *; JLCPCB Part #: *
U6 = PM-REF-431-IL5: 30mA, Low voltage adjustable shunt reference, 1.24 to 6V, 5-Pin SOT23-5, Tape and Reel; ComponentLink1URL: http://www.st.com; ComponentLink1Description: Manufacturer URL; ComponentLink2URL: http://www.st.com/internet/com/TECHNICAL_RESOURCES/TECHNICAL_LITERATURE/DATASHEET/CD00001336.pdf; PackageVersion: 2010; ComponentLink2Description: Datasheet; PackageReference: SOT23-5; PackageDescription: 5-Pin SOT-23 Package, 2.9 x 1.6 mm Body, 0.95 mm Pitch, 2.8 mm Lead Span; DatasheetVersion: Aug-2010; Parameter 1: *; JLCPCB Part #: *
U10 = ADI-ADR34xx-RJ-6: Micropower, High Accuracy Voltage Reference, 3.3 V Output, 3.5 to 5.5 V Supply, Industrial, 6-pin SOT23 (RJ-6), Reel; PartNumber: ADR3433ARJZ-R2; Manufacturer: Analog Devices; Ref Out TC (ppm/C): 8; Vout: 3.3V; Min V Supply (V): 3.5; Max V Supply (V): 5.5; Mounting Technology: Surface Mount; ComponentLink1URL: http://www.analog.com/en/index.html; ComponentLink1Description: Manufacturer URL; PackageVersion: 121608-A, 12/2008; Operating Temp Range: -40 to 125 degC; Packing: Reel; ComponentLink2Description: Datasheet; PackageDescription: 6-Pin Small Outline Transistor Package, Body 2.9 x 1.6 mm, Pitch 0.95 mm; ComponentLink4Description: URL Link1; ComponentLink3Description: Package Specification; Code_JEDEC: MO-178-AB; DatasheetVersion: Rev. B; PackageReference: RJ-6; ComponentLink4URL: Product URL:http://www.analog.com/en/special-linear-functions/voltage-references/adr3433/products/product.html; ComponentLink3URL: http://www.analog.com/static/imported-files/packages/PKG_PDF/SOT-23(RJ)/RJ_6.pdf; ComponentLink2URL: http://www.analog.com/static/imported-files/data_sheets/ADR3412_ADR3420_ADR3425_ADR3430_ADR3433_ADR3440_ADR3450.pdf; Parameter 1: *; JLCPCB Part #: *
X1 = CMP-2000-05728-1: Ceramics Ultra Miniature Quartz Crystal, 24 MHz, +/- 20 ppm, -40 to 85 degC, 4-Pin SMD, RoHS, Tape and Reel; Load Capacitance: 10pF; Frequency Stability: 20PPM; ESR: 120Ohms; Frequency: 20MHz; Case Height: 0.59mm; Brand: ABRACON; Case Width: 1.6mm; Case Length: 2mm; Manufacturer URL: http://www.abracon.com/; RoHS: Details; Datasheet Version: 06/2015; Product Category: Crystals; Type: UltraMiniatureQuartzCrystal; Mounting Style: SMD/SMT; Termination Style: SMD/SMT; Packaging: Reel; Factory Pack Quantity: 3000; Mounting Technology: SurfaceMount; Operating Temperature Range: -40Cto+85C; Tolerance: 20PPM; Datasheet URL: http://www.abracon.com/Resonators/ABM11.pdf; Dimensions: 1.6mmWx2mmLx0.59mmH; Package Description: 4-Pin Surface Mount Device, Body 2 x 1.6 mm, Pitch 1.3 mm; Series: ABM11; Manufacturer: ABRACON; Package / Case: 2mmx1.6mmx0.59mm; Package Reference: ABM11; Parameter 1: *; JLCPCB Part #: *
Y1 = CMP-2000-07587-1: Tuning Fork Crystal, 32.768 KHz, +/- 20 ppm, -40 to 85 degC, 2-Pin SMD, RoHS, Tape and Reel; Manufacturer: Abracon; Case\/Package: SMD/SMT; Series Resistance: 60KOhm; Frequency Tolerance: 20ppm; Load Capacitance: 6pF; ESR (Equivalent Series Resistance): 55KOhm; Max Operating Temperature: 85degC; Width: 0.061inch; Radiation Hardening: No; Lead Free: LeadFree; RoHSCompliant: True; Depth: 1.5mm; Datasheet URL: http://www.abracon.com/Resonators/ABS07-120-32.768kHz-T.pdf; Frequency: 32.768KHz; Termination: SMD/SMT; Manufacturer URL: http://www.abracon.com/; Package Quantity: 3000; Packaging: TapeandReel; Number of Pins: 2; Height: 0.035inch; Package Description: 2-Pin Surface Mount Device, Body 3.2 x 1.5 mm; Package Reference: ABS07; Mount: SurfaceMount; Tolerance: 20ppm; Mounting Technology: SurfaceMount; REACH SVHC: NoSVHC; Datasheet Version: 11/2014; Length: 3.2mm; Min Operating Temperature: -40degC; Parameter 1: *; JLCPCB Part #: C32346